# Altium schematic sheet vtf-schem-v1.SchDoc
size A4
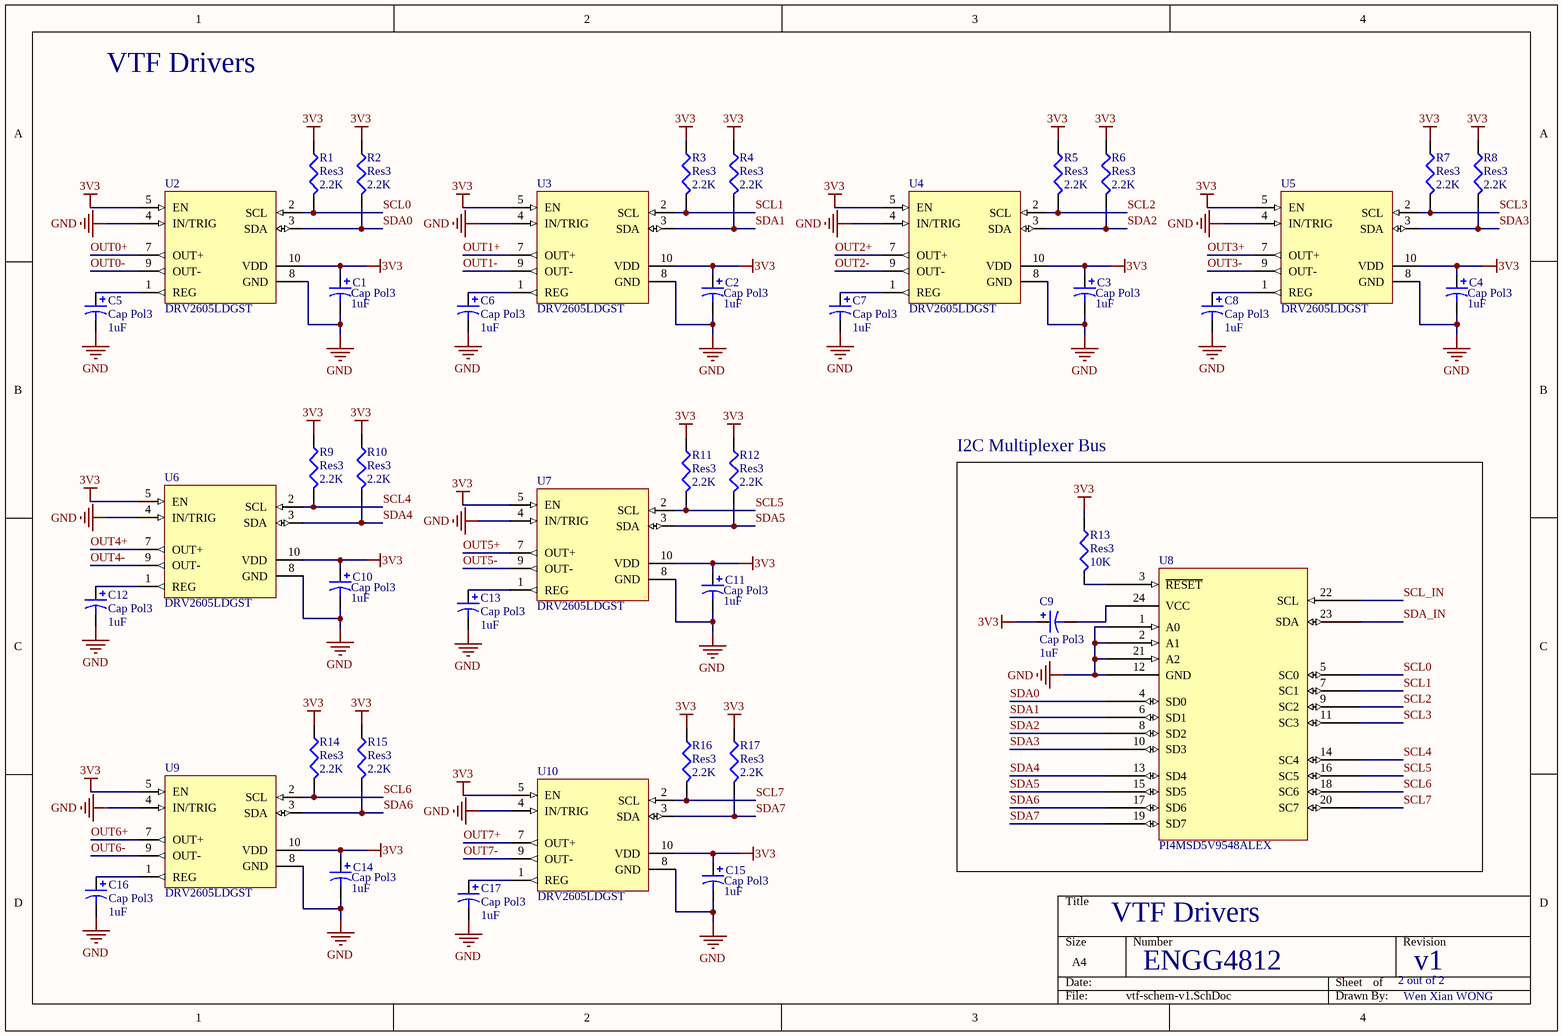
[diagram p0: vtf-schem-v1.SchDoc]

## Parts
C1  Cap Pol3  value 1uF  [0402]
C2  Cap Pol3  value 1uF  [0402]
C3  Cap Pol3  value 1uF  [0402]
C4  Cap Pol3  value 1uF  [0402]
C5  Cap Pol3  value 1uF  [0402]
C6  Cap Pol3  value 1uF  [0402]
C7  Cap Pol3  value 1uF  [0402]
C8  Cap Pol3  value 1uF  [0402]
C9  Cap Pol3  value 1uF  [0402]
C10  Cap Pol3  value 1uF  [0402]
C11  Cap Pol3  value 1uF  [0402]
C12  Cap Pol3  value 1uF  [0402]
C13  Cap Pol3  value 1uF  [0402]
C14  Cap Pol3  value 1uF  [0402]
C15  Cap Pol3  value 1uF  [0402]
C16  Cap Pol3  value 1uF  [0402]
C17  Cap Pol3  value 1uF  [0402]
R1  Res3  value 2.2K  [0402]
R2  Res3  value 2.2K  [0402]
R3  Res3  value 2.2K  [0402]
R4  Res3  value 2.2K  [0402]
R5  Res3  value 2.2K  [0402]
R6  Res3  value 2.2K  [0402]
R7  Res3  value 2.2K  [0402]
R8  Res3  value 2.2K  [0402]
R9  Res3  value 2.2K  [0402]
R10  Res3  value 2.2K  [0402]
R11  Res3  value 2.2K  [0402]
R12  Res3  value 2.2K  [0402]
R13  Res3  value 10K  [0402]
R14  Res3  value 2.2K  [0402]
R15  Res3  value 2.2K  [0402]
R16  Res3  value 2.2K  [0402]
R17  Res3  value 2.2K  [0402]
U2  DRV2605LDGST  [Driver]
U3  DRV2605LDGST  [Driver]
U4  DRV2605LDGST  [Driver]
U5  DRV2605LDGST  [Driver]
U6  DRV2605LDGST  [Driver]
U7  DRV2605LDGST  [Driver]
U8  PI4MSD5V9548ALEX  [I2C bus]
U9  DRV2605LDGST  [Driver]
U10  DRV2605LDGST  [Driver]

## Blocks framed on the sheet
I2C Multiplexer Bus: C9 R13 U8

## Nets
3V3: C1.1 C2.1 C3.1 C4.1 C9.1 C10.1 C11.1 C14.1 C15.1 R1.1 R2.1 R3.1 R4.1 R5.1 R6.1 R7.1 R8.1 R9.1 R10.1 R11.1 R12.1 R13.1 R14.1 R15.1 R16.1 R17.1 U2.5(EN) U2.10(VDD) U3.5(EN) U3.10(VDD) U4.5(EN) U4.10(VDD) U5.5(EN) U5.10(VDD) U6.5(EN) U6.10(VDD) U7.5(EN) U7.10(VDD) U9.5(EN) U9.10(VDD) U10.5(EN) U10.10(VDD)
GND: C1.2 C2.2 C3.2 C4.2 C5.2 C6.2 C7.2 C8.2 C10.2 C11.2 C12.2 C13.2 C14.2 C15.2 C16.2 C17.2 U2.4(IN/TRIG) U2.8(GND) U3.4(IN/TRIG) U3.8(GND) U4.4(IN/TRIG) U4.8(GND) U5.4(IN/TRIG) U5.8(GND) U6.4(IN/TRIG) U6.8(GND) U7.4(IN/TRIG) U7.8(GND) U8.1(A0) U8.2(A1) U8.12(GND) U8.21(A2) U9.4(IN/TRIG) U9.8(GND) U10.4(IN/TRIG) U10.8(GND)
OUT0+: U2.7(OUT+)
OUT0-: U2.9(OUT-)
OUT1+: U3.7(OUT+)
OUT1-: U3.9(OUT-)
OUT2+: U4.7(OUT+)
OUT2-: U4.9(OUT-)
OUT3+: U5.7(OUT+)
OUT3-: U5.9(OUT-)
OUT4+: U6.7(OUT+)
OUT4-: U6.9(OUT-)
OUT5+: U7.7(OUT+)
OUT5-: U7.9(OUT-)
OUT6+: U9.7(OUT+)
OUT6-: U9.9(OUT-)
OUT7+: U10.7(OUT+)
OUT7-: U10.9(OUT-)
SCL0: R1.2 U2.2(SCL) U8.5(SC0)
SCL1: R3.2 U3.2(SCL) U8.7(SC1)
SCL2: R5.2 U4.2(SCL) U8.9(SC2)
SCL3: R7.2 U5.2(SCL) U8.11(SC3)
SCL4: R9.2 U6.2(SCL) U8.14(SC4)
SCL5: R11.2 U7.2(SCL) U8.16(SC5)
SCL6: R14.2 U8.18(SC6) U9.2(SCL)
SCL7: R16.2 U8.20(SC7) U10.2(SCL)
SCL_IN: U8.22(SCL)
SDA0: R2.2 U2.3(SDA) U8.4(SD0)
SDA1: R4.2 U3.3(SDA) U8.6(SD1)
SDA2: R6.2 U4.3(SDA) U8.8(SD2)
SDA3: R8.2 U5.3(SDA) U8.10(SD3)
SDA4: R10.2 U6.3(SDA) U8.13(SD4)
SDA5: R12.2 U7.3(SDA) U8.15(SD5)
SDA6: R15.2 U8.17(SD6) U9.3(SDA)
SDA7: R17.2 U8.19(SD7) U10.3(SDA)
SDA_IN: U8.23(SDA)
NetC5_1: C5.1 U2.1(REG)
NetC6_1: C6.1 U3.1(REG)
NetC7_1: C7.1 U4.1(REG)
NetC8_1: C8.1 U5.1(REG)
NetC9_2: C9.2 U8.24(VCC)
NetC12_1: C12.1 U6.1(REG)
NetC13_1: C13.1 U7.1(REG)
NetC16_1: C16.1 U9.1(REG)
NetC17_1: C17.1 U10.1(REG)
NetR13_2: R13.2 U8.3(~{RESET})

## Notes on the sheet
- VTF Drivers
- ENGG4812
- 2 out of 2
- v1
- Wen Xian WONG

## Library data of the parts
C1-C17 = Cap Pol3: Polarized Capacitor (Surface Mount); Published: 8-Jun-2000; LatestRevisionDate: 29-May-2009; LatestRevisionNote: IPC-7351 Footprint Added.; Publisher: Altium Limited; PackageDescription: Chip Capacitor
  C1-C4 C6-C17: PackageReference: C0805
  C5: PackageReference: 0402
R1-R17 = Res3: Resistor; Published: 8-Jun-2000; LatestRevisionDate: 29-May-2009; LatestRevisionNote: IPC-7351 Footprint Added.; PackageReference: J1-0603; Publisher: Altium Limited; PackageDescription: Chip Resistor
U8 = I2C Bus